# EAGLE design sensor hub (EAGLE 6.5.0)
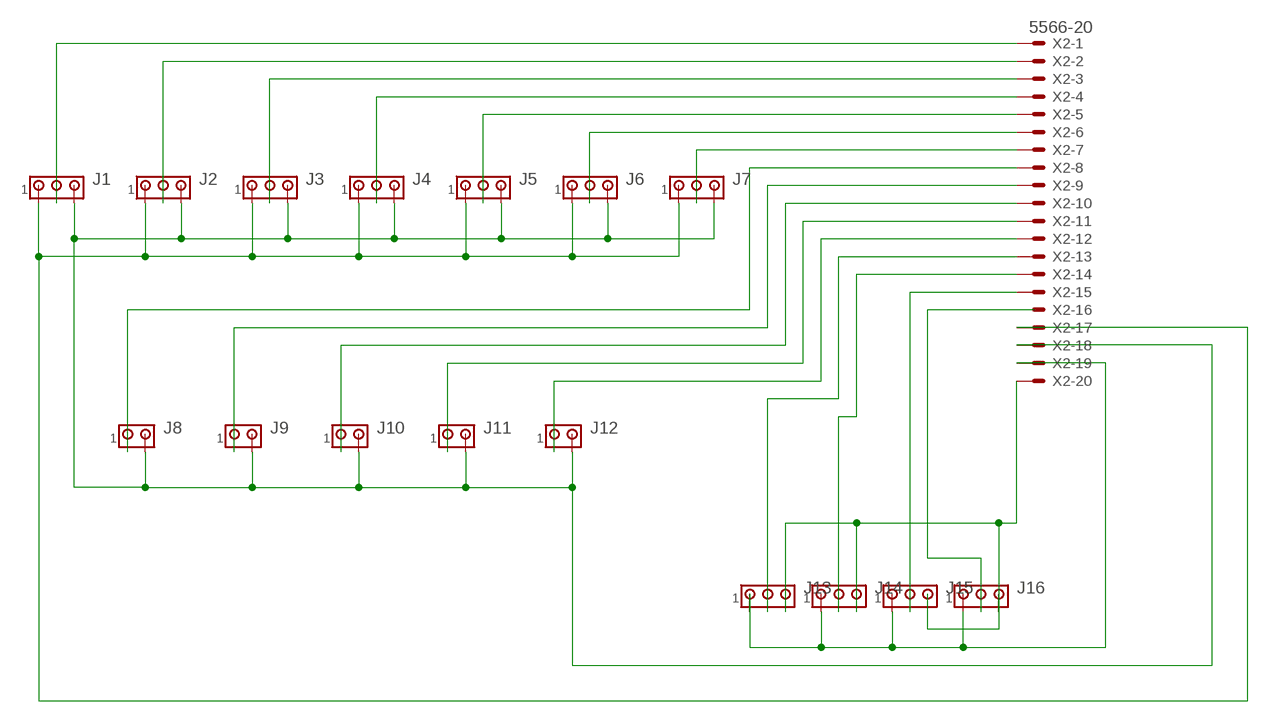
[diagram p0: schematic, sheet 1]

## Parts
J1  MTA03-156  [1X3MTA]
J2  MTA03-156  [1X3MTA]
J3  MTA03-156  [1X3MTA]
J4  MTA03-156  [1X3MTA]
J5  MTA03-156  [1X3MTA]
J6  MTA03-156  [1X3MTA]
J7  MTA03-156  [1X3MTA]
J8  MTA02-156  [1X2MTA]
J9  MTA02-156  [1X2MTA]
J10  MTA02-156  [1X2MTA]
J11  MTA02-156  [1X2MTA]
J12  MTA02-156  [1X2MTA]
J13  MTA03-156  [1X3MTA]
J14  MTA03-156  [1X3MTA]
J15  MTA03-156  [1X3MTA]
J16  MTA03-156  [1X3MTA]
X2  5566-20  [5566-20]

## Nets
N$1: J13.2 X2.13
N$2: J14.2 X2.14
N$3: J15.2 X2.15
N$4: J5.2 X2.5
N$5: J6.2 X2.6
N$6: J11.1 X2.11
N$7: J12.1 X2.12
N$8: J16.2
N$9: J14.1 J15.1 J16.1 X2.19
N$10: J13.3 J14.3 J16.3 X2.20
N$19: J1.2 X2.1
N$20: J2.2 X2.2
N$21: J3.2 X2.3
N$22: J4.2 X2.4
N$25: J7.2 X2.7
N$26: J8.1 X2.8
N$27: J9.1 X2.9
N$28: J10.1 X2.10
N$35: J1.3 J2.3 J3.3 J4.3 J5.3 J6.3 J7.3 J8.2 J9.2 J10.2 J11.2 J12.2 X2.18
N$36: J1.1 J2.1 J3.1 J4.1 J5.1 J6.1 J7.1 X2.17
Unconnected: J13.1 J15.3 X2.16

## Library data of the parts
J1-J7 J13-J16 = con-amp:MTA03-156: AMP connector
J8-J12 = con-amp:MTA02-156: AMP connector
X2 = con-molex:5566-20: Mini FIT connector 20 pol ATX PC-Motherboard Power connector Source: http://www.molex.com; OC_FARNELL: unknown; OC_NEWARK: unknown

## Board
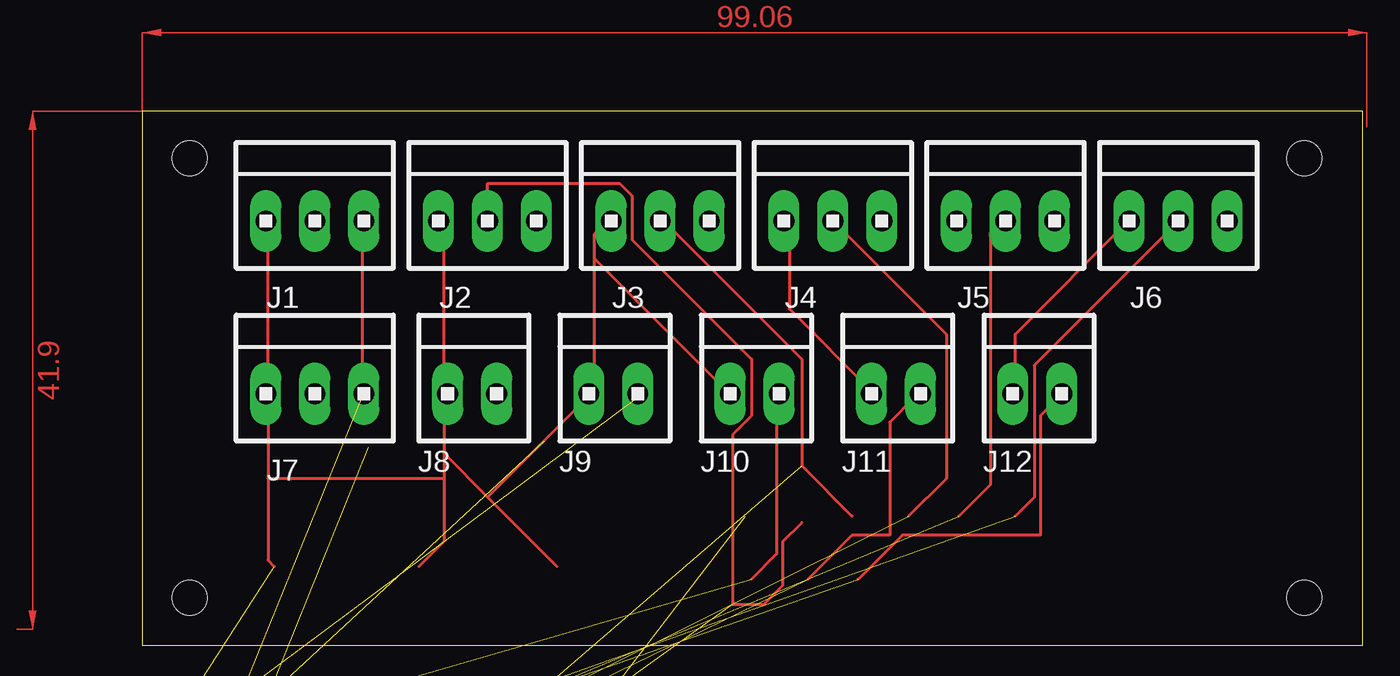
[diagram p1: board, top side]
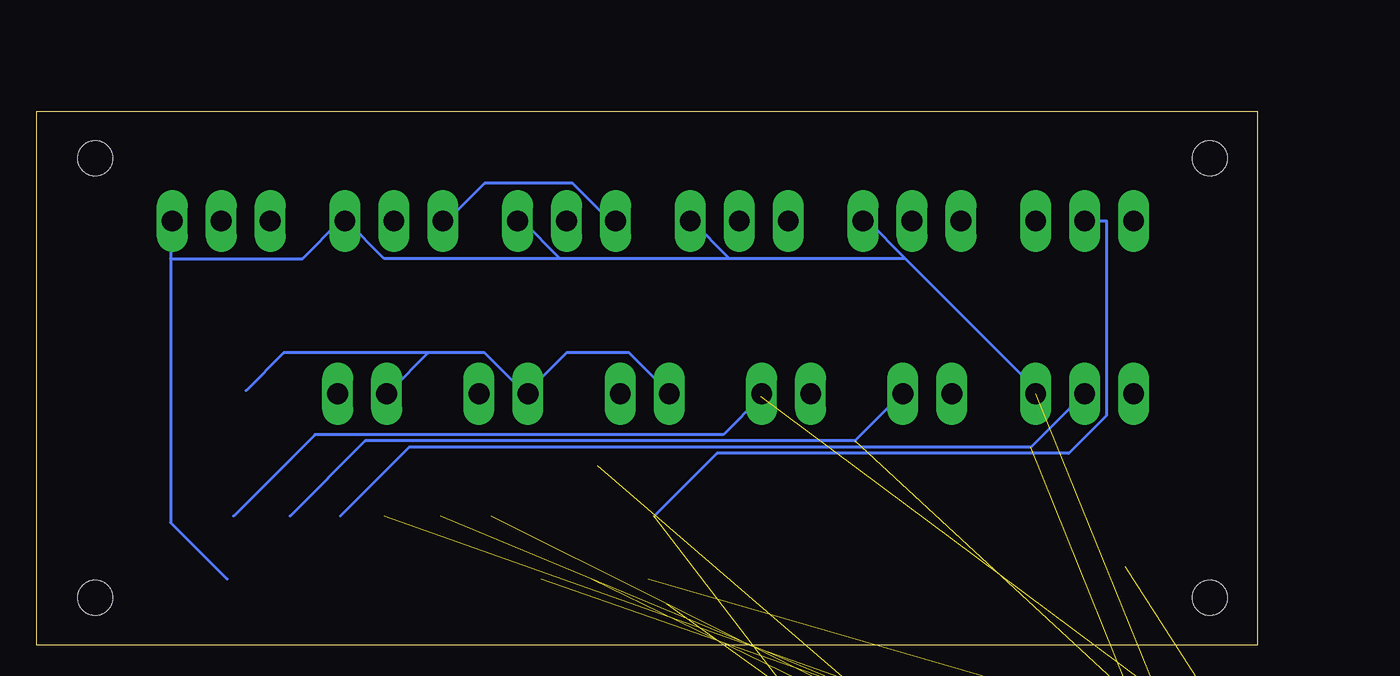
[diagram p2: board, bottom side, seen from below]

Size 98.73 x 43.17 mm. Coordinates in mm from the lower left corner, seen from the top.
Outline: 0,0 98.73,0 98.73,43.17 0,43.17 0,0
Copper layers (1*16): Top 0.035mm / dielectric 1.5mm / Bottom 0.035mm
Design rules "default": minimum track width 10mil, minimum drill 24mil, track to track 8mil, track to pad 8mil, pad to pad 8mil, via to via 8mil, smd to smd 8mil, copper to edge 40mil, drill to drill 8mil, minimum pad ring 10mil, minimum via ring 8mil, stop-mask expansion 4mil, vias tented up to drill 0mil, thermal gap 10mil
Holes 2.8 mm at 3.81,39.37 3.81,3.81 93.98,39.37 93.98,3.81

### Footprints (pad centres in the part's own frame; a part is rotated, then mirrored left to right if it is on the bottom)
1X3MTA = drill 1.676 long: 1 3.937,0; 2 -0.025,0; 3 -3.988,0
1X2MTA = drill 1.676 long: 1 1.981,0; 2 -1.981,0
5566-20 = drill 1.4 square: 1 18.9,-2.75; 2 14.7,-2.75; 3 10.5,-2.75; 4 6.3,-2.75; 5 2.1,-2.75; 6 -2.1,-2.75; 7 -6.3,-2.75; 8 -10.5,-2.75; 9 -14.7,-2.75; 10 -18.9,-2.75; 11 18.9,2.75; 12 14.7,2.75; 13 10.5,2.75; 14 6.3,2.75; 15 2.1,2.75; 16 -2.1,2.75; 17 -6.3,2.75; 18 -10.5,2.75; 19 -14.7,2.75; 20 -18.9,2.75 | hole 3: 23.6,2.29; -23.6,2.29

### Placement (x,y rotation side)
J1  13.97,34.29 0 top
J2  27.94,34.29 0 top
J3  41.91,34.29 0 top
J4  55.88,34.29 0 top
J5  69.85,34.29 0 top
J6  83.82,34.29 0 top
J7  13.97,20.32 0 top
J8  26.67,20.32 0 top
J9  38.1,20.32 0 top
J10  49.53,20.32 0 top
J11  60.96,20.32 0 top
J12  72.39,20.32 0 top
J13  -19.05,-6.35 0 top  (outside the outline)
J14  -33.02,-6.35 0 top  (outside the outline)
J15  -46.99,-6.35 0 top  (outside the outline)
J16  -60.96,-6.35 0 top  (outside the outline)
X2  13.97,-7.62 0 top  (outside the outline)

### Tracks (layer width: path | path; a pad name or v marks a point on that pad's centre or on a via)
N$1  (1 unrouted)
N$2  (1 unrouted)
N$3  (1 unrouted)
N$4  (1 unrouted)
  Top 0.254: 66.04,10.41 68.58,12.95 68.58,33.27 69.6,34.29 J5.2
N$5  (1 unrouted)
  Top 0.254: 70.61,10.41 72.14,11.94 72.14,22.61 83.31,33.78 83.31,34.29 J6.2
N$6  (1 unrouted)
  Top 0.254: 53.85,5.33 57.4,8.89 60.45,8.89 60.45,18.03 62.48,20.07 J11.1
N$7  (1 unrouted)
  Top 0.254: 57.91,5.33 61.47,8.89 72.64,8.89 72.64,18.54 74.17,20.07 J12.1
N$9  (3 unrouted)
N$10  (3 unrouted)
N$19  (1 unrouted)
  Bottom 0.254: 48.77,10.41 43.69,15.49 15.24,15.49 12.19,18.54 12.19,34.29 J1.2
N$20  (1 unrouted)
  Top 0.254: 53.34,9.91 51.82,8.38 51.82,4.83 50.29,3.3 47.75,3.3 47.75,17.02 49.28,18.54 49.28,23.11 39.62,32.77 39.62,36.32 38.61,37.34 27.94,37.34 27.94,34.29 J2.2
N$21  (1 unrouted)
  Top 0.254: 57.4,10.41 53.34,14.48 53.34,23.11 42.16,34.29 J3.2
N$22  (1 unrouted)
  Top 0.254: 61.98,10.41 65.02,13.46 65.02,25.15 55.88,34.29 J4.2
N$25  (1 unrouted)
  Bottom 0.254: 74.17,10.41 68.58,16 18.29,16 14.22,20.07 J7.2
N$26  (1 unrouted)
  Bottom 0.254: 78.23,10.41 72.14,16.51 32.51,16.51 28.96,20.07 J8.1
N$27  (1 unrouted)
  Bottom 0.254: 82.8,10.41 76.2,17.02 43.18,17.02 40.13,20.07 J9.1
N$28  (1 unrouted)
  Top 0.254: 49.28,5.33 51.31,7.37 51.31,20.07 J10.1
N$35  (1 unrouted)
  Top 0.254: J11.2 58.93,20.57 52.32,27.18 52.32,34.29 J4.3 | J6.3 79.76,34.29 70.61,25.15 70.61,20.57 J12.2 | 10.67,6.35 10.16,6.86 10.16,13.46 | 10.16,13.46 10.16,20.07 J7.3 10.16,20.57 10.16,34.29 J1.3 | 22.35,6.35 24.38,8.38 24.38,13.46 | 24.38,15.49 24.38,20.07 J8.2 24.38,20.57 24.38,34.29 J2.3 | 24.38,15.49 24.38,13.46 | 24.38,15.49 27.94,11.94 | 27.94,11.94 33.53,6.35 | 27.94,11.94 36.07,20.07 J9.2 36.58,20.57 36.58,31.24 | 36.58,31.24 36.58,33.27 37.59,34.29 J3.3 | 36.58,31.24 47.24,20.57 J10.2 | 24.38,13.46 10.16,13.46
  Bottom 0.254: 67.06,23.62 70.1,20.57 J12.2 | 67.06,23.62 62.48,23.62 59.44,20.57 J11.2 58.93,20.57 55.88,23.62 50.8,23.62 47.75,20.57 J10.2 | J5.3 65.53,34.29 62.48,37.34 55.37,37.34 52.32,34.29 J4.3 | 81.79,20.57 78.74,23.62 67.06,23.62
N$36  (1 unrouted)
  Top 0.254: J7.1 17.78,20.57 17.78,34.29 J1.1
  Bottom 0.254: 83.31,5.33 87.88,9.91 87.88,31.24 | 87.88,31.24 87.88,34.29 J6.1 | 87.88,31.24 77.22,31.24 74.17,34.29 J5.1 73.66,34.29 70.61,31.24 56.39,31.24 | 28.45,31.24 17.78,20.57 J7.1 | 28.45,31.24 31.5,34.29 J2.1 | 42.67,31.24 45.72,34.29 J3.1 | 28.45,31.24 42.67,31.24 | 56.39,31.24 59.44,34.29 J4.1 | 42.67,31.24 56.39,31.24
(copper drawn outside any net)
  shapes: Top area x2